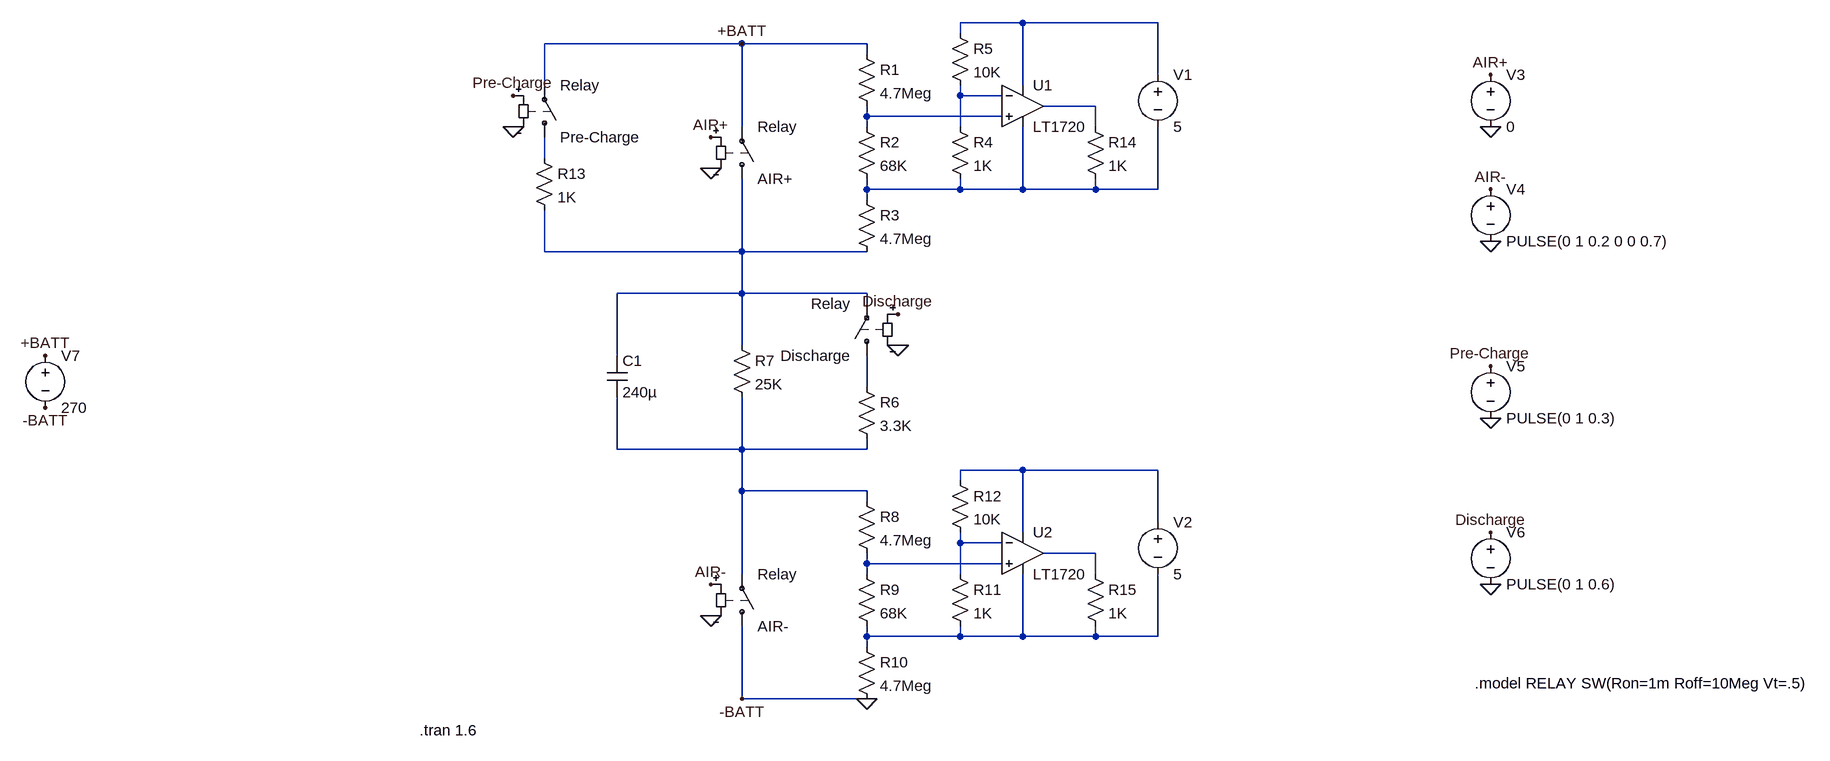
[diagram p0: schematic ResistiveDetection.asc]
ResistiveDetection.asc, the LTspice schematic file:
Version 4
SHEET 1 1640 944
WIRE 416 -160 320 -160
WIRE 624 -160 416 -160
WIRE 320 -144 320 -160
WIRE -16 -128 -320 -128
WIRE 176 -128 -16 -128
WIRE 176 -112 176 -128
WIRE 624 -80 624 -160
WIRE -320 -64 -320 -128
WIRE 416 -64 416 -160
WIRE 320 -48 320 -64
WIRE 384 -48 320 -48
WIRE 528 -32 448 -32
WIRE 176 -16 176 -32
WIRE 384 -16 176 -16
WIRE -16 0 -16 -128
WIRE 176 0 176 -16
WIRE 320 0 320 -48
WIRE 528 0 528 -32
WIRE -320 48 -320 16
WIRE 176 96 176 80
WIRE 320 96 320 80
WIRE 320 96 176 96
WIRE 416 96 416 0
WIRE 416 96 320 96
WIRE 528 96 528 80
WIRE 528 96 416 96
WIRE 624 96 624 0
WIRE 624 96 528 96
WIRE 176 112 176 96
WIRE -320 192 -320 128
WIRE -16 192 -16 80
WIRE -16 192 -320 192
WIRE 176 192 -16 192
WIRE -16 256 -16 192
WIRE -16 256 -208 256
WIRE 176 256 -16 256
WIRE 176 272 176 256
WIRE -16 336 -16 256
WIRE -208 352 -208 256
WIRE 176 400 176 352
WIRE -208 496 -208 416
WIRE -16 496 -16 416
WIRE -16 496 -208 496
WIRE 176 496 176 480
WIRE 176 496 -16 496
WIRE 416 528 320 528
WIRE 624 528 416 528
WIRE 320 544 320 528
WIRE -16 560 -16 496
WIRE 176 560 -16 560
WIRE 176 576 176 560
WIRE 624 608 624 528
WIRE 416 624 416 528
WIRE 320 640 320 624
WIRE 384 640 320 640
WIRE 528 656 448 656
WIRE 176 672 176 656
WIRE 384 672 176 672
WIRE -16 688 -16 560
WIRE 176 688 176 672
WIRE 320 688 320 640
WIRE 528 688 528 656
WIRE 176 784 176 768
WIRE 320 784 320 768
WIRE 320 784 176 784
WIRE 416 784 416 688
WIRE 416 784 320 784
WIRE 528 784 528 768
WIRE 528 784 416 784
WIRE 624 784 624 688
WIRE 624 784 528 784
WIRE 176 800 176 784
WIRE -16 880 -16 768
WIRE 176 880 -16 880
FLAG -16 -128 +BATT
FLAG -16 880 -BATT
FLAG 1136 0 0
FLAG 1136 176 0
FLAG 1136 448 0
FLAG 1136 704 0
FLAG -64 64 0
FLAG 224 336 0
FLAG -64 752 0
FLAG -368 0 0
FLAG 1136 -80 AIR+
FLAG 1136 96 AIR-
FLAG -64 704 AIR-
FLAG 1136 368 Pre-Charge
FLAG -368 -48 Pre-Charge
FLAG 1136 624 Discharge
FLAG 224 288 Discharge
FLAG -64 16 AIR+
FLAG -1088 352 +BATT
FLAG -1088 432 -BATT
FLAG 176 880 0
SYMBOL res 160 -128 R0
SYMATTR InstName R1
SYMATTR Value 4.7Meg
SYMBOL res 160 -16 R0
SYMATTR InstName R2
SYMATTR Value 68K
SYMBOL res 160 96 R0
SYMATTR InstName R3
SYMATTR Value 4.7Meg
SYMBOL Comparators\\LT1720 416 -96 R0
SYMATTR InstName U1
SYMBOL res 304 -16 R0
SYMATTR InstName R4
SYMATTR Value 1K
SYMBOL res 304 -160 R0
SYMATTR InstName R5
SYMATTR Value 10K
SYMBOL voltage 624 -96 R0
SYMATTR InstName V1
SYMATTR Value 5
SYMBOL sw -16 96 M180
SYMATTR InstName AIR+
SYMATTR Value Relay
SYMBOL sw 176 368 R180
SYMATTR InstName Discharge
SYMATTR Value Relay
SYMBOL res 160 384 R0
SYMATTR InstName R6
SYMATTR Value 3.3K
SYMBOL res -32 320 R0
SYMATTR InstName R7
SYMATTR Value 25K
SYMBOL cap -224 352 R0
SYMATTR InstName C1
SYMATTR Value 240µ
SYMBOL res 160 560 R0
SYMATTR InstName R8
SYMATTR Value 4.7Meg
SYMBOL res 160 672 R0
SYMATTR InstName R9
SYMATTR Value 68K
SYMBOL res 160 784 R0
SYMATTR InstName R10
SYMATTR Value 4.7Meg
SYMBOL Comparators\\LT1720 416 592 R0
SYMATTR InstName U2
SYMBOL res 304 672 R0
SYMATTR InstName R11
SYMATTR Value 1K
SYMBOL res 304 528 R0
SYMATTR InstName R12
SYMATTR Value 10K
SYMBOL voltage 624 592 R0
SYMATTR InstName V2
SYMATTR Value 5
SYMBOL sw -16 784 M180
SYMATTR InstName AIR-
SYMATTR Value Relay
SYMBOL sw -320 32 M180
SYMATTR InstName Pre-Charge
SYMATTR Value Relay
SYMBOL res -336 32 R0
SYMATTR InstName R13
SYMATTR Value 1K
SYMBOL voltage 1136 -96 R0
WINDOW 123 0 0 Left 2
WINDOW 39 0 0 Left 2
SYMATTR InstName V3
SYMATTR Value 0
SYMBOL voltage 1136 80 R0
WINDOW 123 0 0 Left 2
WINDOW 39 0 0 Left 2
SYMATTR InstName V4
SYMATTR Value PULSE(0 1 0.2 0 0 0.7)
SYMBOL voltage 1136 352 R0
WINDOW 123 0 0 Left 2
WINDOW 39 0 0 Left 2
SYMATTR InstName V5
SYMATTR Value PULSE(0 1 0.3)
SYMBOL voltage 1136 608 R0
WINDOW 123 0 0 Left 2
WINDOW 39 0 0 Left 2
SYMATTR InstName V6
SYMATTR Value PULSE(0 1 0.6)
SYMBOL voltage -1088 336 R0
SYMATTR InstName V7
SYMATTR Value 270
SYMBOL res 512 -16 R0
SYMATTR InstName R14
SYMATTR Value 1K
SYMBOL res 512 672 R0
SYMATTR InstName R15
SYMATTR Value 1K
TEXT -512 928 Left 2 !.tran 1.6
TEXT 1112 856 Left 2 !.model RELAY SW(Ron=1m Roff=10Meg Vt=.5)

The netlist it stands for:
* ResistiveDetection.asc
R1 +BATT N004 4.7Meg
R2 N004 N006 68K
R3 N006 N007 4.7Meg
XU1 N004 N002 N001 N006 N003 LT1720  ; pins In+ In- V+ V- OUT
R4 N002 N006 1K
R5 N001 N002 10K
V1 N001 N006 5
S§AIR+ N007 +BATT AIR+ 0 Relay
S§Discharge N008 N007 Discharge 0 Relay
R6 N008 N009 3.3K
R7 N007 N009 25K
C1 N007 N009 240µ
R8 N009 N013 4.7Meg
R9 N013 N014 68K
R10 N014 0 4.7Meg
XU2 N013 N011 N010 N014 N012 LT1720  ; pins In+ In- V+ V- OUT
R11 N011 N014 1K
R12 N010 N011 10K
V2 N010 N014 5
S§AIR- 0 N009 AIR- 0 Relay
S§Pre-Charge N005 +BATT Pre-Charge 0 Relay
R13 N005 N007 1K
V3 AIR+ 0 0
V4 AIR- 0 PULSE(0 1 0.2 0 0 0.7)
V5 Pre-Charge 0 PULSE(0 1 0.3)
V6 Discharge 0 PULSE(0 1 0.6)
V7 +BATT 0 270
R14 N003 N006 1K
R15 N012 N014 1K
.tran 1.6
.model RELAY SW(Ron=1m Roff=10Meg Vt=.5)
.lib LT1720.sub
.backanno
.end

* Results of the author's LTspice run, read from the files saved beside the schematic
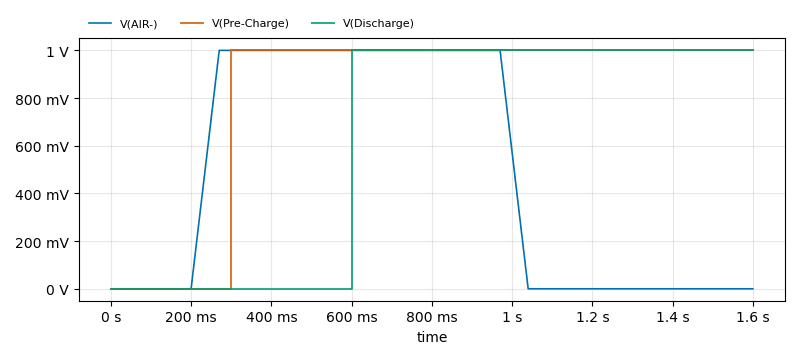
[diagram p1: Transient Analysis of ResistiveDetection.asc, plotted from the saved traces]
* Transient Analysis, 1 run:
*   V(AIR-): min 0 V, max 1 V, average 481.3 mV, rms 684.6 mV, last 0 V
*   V(Pre-Charge): min 0 V, max 1 V, average 812.5 mV, rms 901.4 mV, last 1 V
*   V(Discharge): min 0 V, max 1 V, average 625 mV, rms 790.6 mV, last 1 V